# EAGLE design controlPanel (EAGLE 9.6.2)
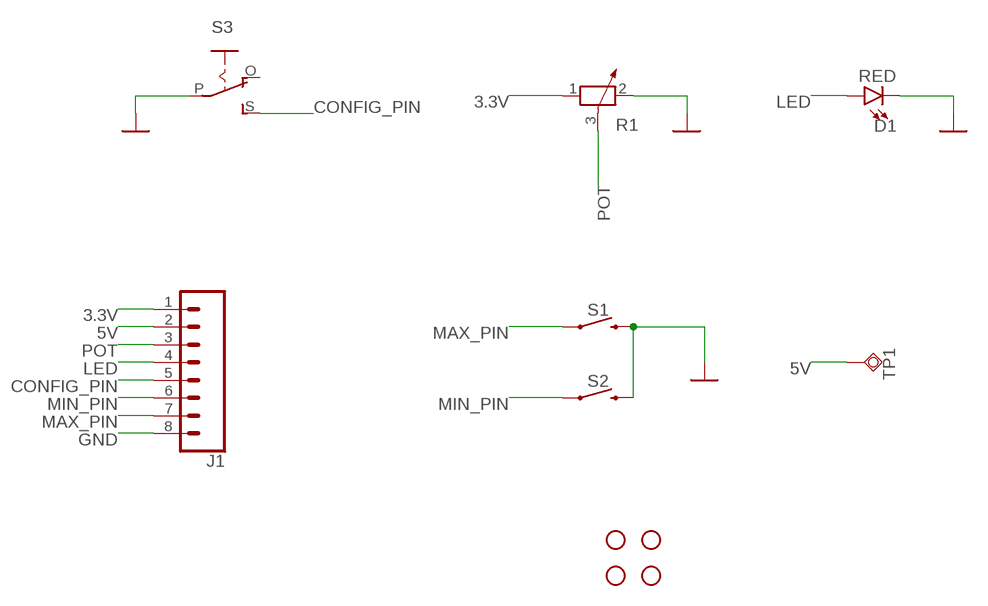
[diagram p0: schematic, sheet 1]

## Parts
D1  RED  SPARKFUN-LED_LED-RED0603  [SPARKFUN-LED_LED-0603]
H1  STAND-OFFTIGHT  [STAND-OFF-TIGHT]
H2  STAND-OFFTIGHT  [STAND-OFF-TIGHT]
H3  STAND-OFFTIGHT  [STAND-OFF-TIGHT]
H4  STAND-OFFTIGHT  [STAND-OFF-TIGHT]
J1  CONN_08SMD-COMBO-FEMALE  [1X08_SMD_COMBINED]
R1  RCL_POTENTIOMETER_PT-10  [RCL_PT-10]
S1  SPARKFUN-SWITCHES_MOMENTARY-SWITCH-SPST-PTH-12MM  [SPARKFUN-SWITCHES_TACTILE_SWITCH_PTH_12MM]
S2  SPARKFUN-SWITCHES_MOMENTARY-SWITCH-SPST-PTH-12MM  [SPARKFUN-SWITCHES_TACTILE_SWITCH_PTH_12MM]
S3  ADAFRUIT_EG1218S  [ADAFRUIT_EG1218]
TP1  TESTPAD_TPSQTP20R  [TESTPAD_TP20R]

## Nets
3.3V: J1.1 R1.1
5V: J1.2 TP1.TP
CONFIG_PIN: J1.5 S3.S
GND: D1.C J1.8 R1.2 S1.3 S2.3 S3.P ; supply symbol labelled 3-5-PIN-SMD_GND
LED: D1.A J1.4
MAX_PIN: J1.7 S1.1
MIN_PIN: J1.6 S2.1
POT: J1.3 R1.3
Unconnected: S3.O

## Library data of the parts
D1 = controlPanel:SPARKFUN-LED_LED-RED: Red SMD LED Used in manufacturing of most products at SparkFun Packages: 0603 - SMD 0603 package [Product Link] <http://docs.avagotech.com/docs/AV02-0551EN> 0603 SMART - SMD 0603 SMART package ( more efficient and expensive)[Product Link] <http://www.osram-os.com/Graphics/XPic2/00077099_0.pdf> 1206 - SMD1206 package [Product Link] <https://www.sparkfun.com/datasheets/DevTools/LilyPad/Q150OVS4.pdff> SparkFun Products: Pro Mini 328 -5V <https://www.sparkfun.com/products/821> RedBoard <https://www.sparkfun.com/products/12757> IOIO-OTG <https://www.sparkfun.com/products/13613>; PROD_ID: DIO-00819
H1-H4 = SparkFun-Hardware:STAND-OFF: Stand Off Drill holes for mechanically mounting via screws, standoffs, etc. Note: Use the keepout ring to avoid running the screw head into surrounding components. Variant Overviews STAND-OFF - Mechanical footprint for a #4 phillips button head screw. STAND-OFF-TIGHT - Mechanical footprint for a #4 phillips button head screw, Example SparkFun Products Screw - Phillips Head (1/4", 4-40, 10 pack) <https://www.sparkfun.com/products/10453> (PRT-10453) Screw - Phillips Head (1/2", 4-40, 10 pack) <https://www.sparkfun.com/products/10452> (PRT-10452) Screw - Phillips Head (3/4", 4-40, 10 pack) <https://www.sparkfun.com/products/10451> (PRT-10451) Screw - Phillips Head (1", 4-40, 10 pack) <https://www.sparkfun.com/products/10450> (PRT-10450)
J1 = SparkFun-Connectors:CONN_08: Multi connection point. Often used as Generic Header-pin footprint for 0.1 inch spaced/style header connections On any of the 0.1 inch spaced packages, you can populate with these: Break Away Headers - Straight <https://www.sparkfun.com/products/116> (PRT-00116) Break Away Male Headers - Right Angle <https://www.sparkfun.com/products/553> (PRT-00553) Female Headers <https://www.sparkfun.com/products/115> (PRT-00115) Break Away Headers - Machine Pin <https://www.sparkfun.com/products/117> (PRT-00117) Break Away Female Headers - Swiss Machine Pin <https://www.sparkfun.com/products/743> (PRT-00743) Arduino Stackable Header - 8 Pin <https://www.sparkfun.com/products/9279> (PRT-09279) For SCREWTERMINALS and SPRING TERMINALS visit here: Screw Terimnals on SparkFun.com <https://www.sparkfun.com/search/results?term=Screw+Terminals> (5mm/3.5mm/2.54mm spacing) This device is also useful as a general connection point to wire up your design to another part of your project. Our various solder wires solder well into these plated through hole pads. Hook-Up Wire - Assortment (Stranded, 22 AWG) <https://www.sparkfun.com/products/11375> (PRT-11375) Hook-Up Wire - Assortment (Solid Core, 22 AWG) <https://www.sparkfun.com/products/11367> (PRT-11367) View the entire wire category on our website here <https://www.sparkfun.com/categories/141> Special notes: Molex polarized connector foot print use with SKU : PRT-08231 with associated crimp pins and housings. 1MM SMD Version SKU: PRT-10208 NOTES ON THE VARIANTS LOCK and LOCK_LONGPADS... This footprint was designed to help hold the alignment of a through-hole component (i.e. 6-pin header) while soldering it into place. You may notice that each hole has been shifted either up or down by 0.005 of an inch from it's more standard position (which is a perfectly straight line). This slight alteration caused the pins (the squares in the middle) to touch the edges of the holes. Because they are alternating, it causes a "brace" to hold the component in place. 0.005 has proven to be the perfect amount of "off-center" position when using our standard breakaway headers. Although looks a little odd when you look at the bare footprint, once you have a header in there, the alteration is very hard to notice. Also,if you push a header all the way into place, it is covered up entirely on the bottom side.; PROD_ID: CONN-10204; SF_ID: PRT-11543
R1 = controlPanel:RCL_POTENTIOMETER_: Potentiometer
S1 S2 = controlPanel:SPARKFUN-SWITCHES_MOMENTARY-SWITCH-SPST: Momentary Switch (Pushbutton) - SPST Normally-open (NO) SPST momentary switches (buttons, pushbuttons). Variants PTH-12MM - 12mm square, through-hole Momentary Pushbutton Switch - 12mm Square <https://www.sparkfun.com/products/9190> (COM-09190) PTH-6.0MM, PTH-6.0MM-KIT - 6.0mm square, through-hole Mini Pushbutton Switch <https://www.sparkfun.com/products/97> (COM-00097) KIT package intended for soldering kit's - only one side of pads' copper is exposed. PTH-RIGHT-ANGLE-KIT - Right-angle, through-hole Right Angle Tactile Button <https://www.sparkfun.com/products/10791> - Used on SparkFun BigTime Watch Kit <https://www.sparkfun.com/products/11734> SMD-12MM - 12mm square, surface-mount Tactile Button - SMD (12mm) <https://www.sparkfun.com/products/12993> (COM-12993) Used on SparkFun PicoBoard <https://www.sparkfun.com/products/11888> SMD-4.5MM - 4.5mm Square Trackball Switch Used on SparkFun Blackberry Trackballer Breakout <https://www.sparkfun.com/products/13169> SMD-4.6MMX2.8MM - 4.60mm x 2.80mm, surface mount Used on SparkFun SAMD21 Mini Breakout <https://www.sparkfun.com/products/13664> SMD-5.2MM, SMD-5.2-REDUNDANT - 5.2mm square, surface-mount Mini Pushbutton Switch - SMD <https://www.sparkfun.com/products/8720> (COM-08720) Used on Arduino Pro Mini <https://www.sparkfun.com/products/11114> REDUNDANT package connects both switch circuits together SMD-6.0X3.5MM - 6.0 x 3.5mm, surface mount Momentary Reset Switch SMD <https://www.sparkfun.com/products/8229> (COM-08229) SMD-6.2MM-TALL - 6.2mm square, surface mount Tactile Button - SMD (6mm) <https://www.sparkfun.com/products/12992> Used on SparkFun Digital Sandbox <https://www.sparkfun.com/products/12651> SMD-RIGHT-ANGLE - Right-angle, surface mount Used on SparkFun Block for Intel® Edison - Arduino <https://www.sparkfun.com/products/13036>; PROD_ID: SWCH-09185; SF_SKU: COM-09190
S3 = controlPanel:ADAFRUIT_EG1218: SLIDING SWITCH 0.1" spacing through hole, vertical SPDT slide switch http://www.ladyada.net/library/pcb/eaglelibrary.html
TP1 = ARDUINO_3V_TTL_INTERFACE_2_PI:TESTPAD_TPSQ: Test pad

## Board
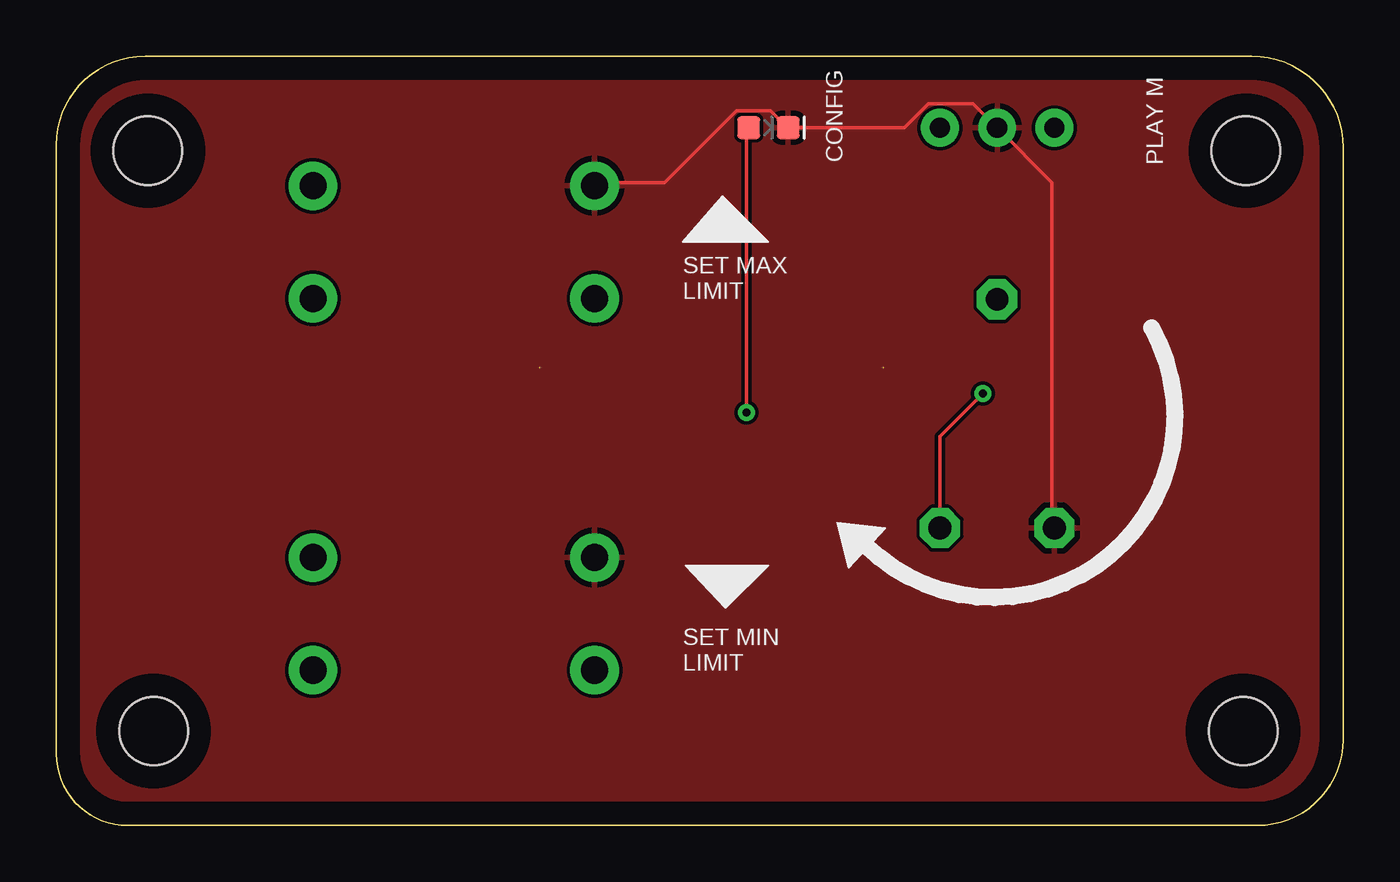
[diagram p1: board, top side]
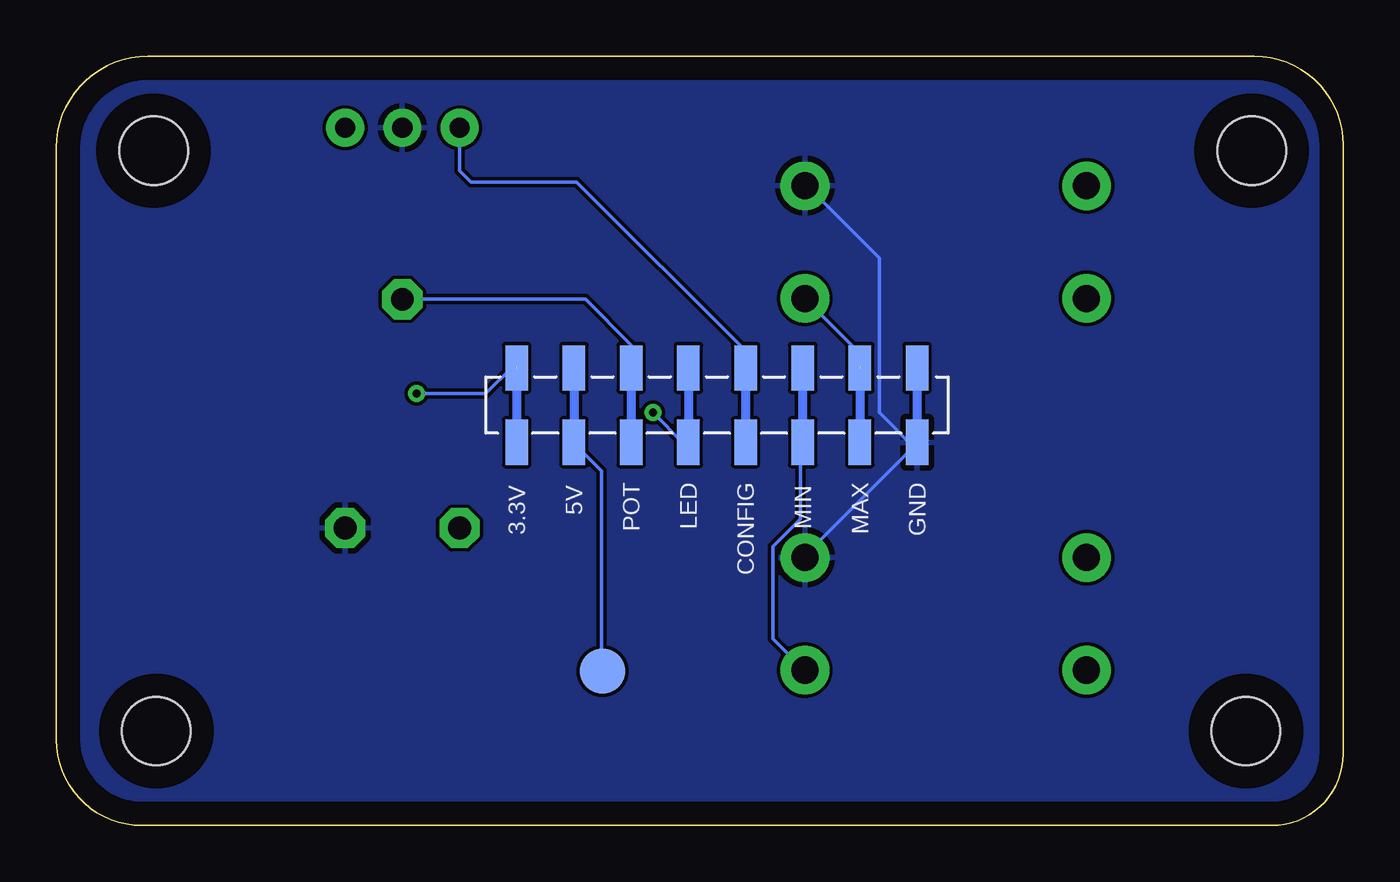
[diagram p2: board, bottom side, seen from below]

Size 57.15 x 34.16 mm. Coordinates in mm from the lower left corner, seen from the top.
Outline: 0,29.08 0,28.96 0,3.18 arc90 3.17,0 53.34,0 arc90 57.15,3.81 57.15,30.1 arc90 53.09,34.16 3.94,34.16 arc90 0,30.23 0,29.08
Copper layers (1*16): Top 0.035mm / dielectric 1.5mm / Bottom 0.035mm
Design rules "default": minimum track width 6mil, minimum drill 0.35mm, track to track 6mil, track to pad 6mil, pad to pad 6mil, via to via 6mil, smd to smd 6mil, copper to edge 40mil, drill to drill 6mil, minimum pad ring 10mil, minimum via ring 8mil, stop-mask expansion 4mil, vias tented up to drill 0mil, thermal gap 10mil

### Footprints (pad centres in the part's own frame; a part is rotated, then mirrored left to right if it is on the bottom)
SPARKFUN-LED_LED-0603 = smd 1 x 1: A -0.877,0; C 0.877,0
STAND-OFF-TIGHT = hole 3.048: 0,0
1X08_SMD_COMBINED = smd 1 x 2: 1 0,1.65; 1@2 0,-1.65; 2 2.54,-1.65; 2@2 2.54,1.65; 3 5.08,1.65; 3@2 5.08,-1.65; 4 7.62,-1.65; 4@2 7.62,1.65; 5 10.16,1.65; 5@2 10.16,-1.65; 6 12.7,-1.65; 6@2 12.7,1.65; 7 15.24,1.65; 7@2 15.24,-1.65; 8 17.78,-1.65; 8@2 17.78,1.65
RCL_PT-10 = drill 1.016 pad 1.778 octagon: 1 -2.54,-5.08; 2 2.54,-5.08; 3 0,5.08
SPARKFUN-SWITCHES_TACTILE_SWITCH_PTH_12MM = drill 1.2 pad 2.159: 1 6.25,-2.5; 2 -6.25,-2.5; 3 6.25,2.5; 4 -6.25,2.5
ADAFRUIT_EG1218 = drill 0.9 pad 1.676: O -2.54,0; P 0,0; S 2.54,0
TESTPAD_TP20R = smd 2 x 2: TP 0,0

### Placement (x,y rotation side)
D1  31.62,30.99 0 top
H1  4.32,4.19 0 top
H2  4.06,29.97 0 top
H3  52.83,29.97 0 top
H4  52.7,4.19 0 top
J1  36.7,18.67 0 bottom
R1  41.78,18.29 0 top
S1  17.65,25.91 0 top
S2  17.65,9.4 0 top
S3  41.78,30.99 180 top
TP1  32.89,6.86 0 bottom

### Tracks (layer width: path | path; a pad name or v marks a point on that pad's centre or on a via)
3.3V  (via drill 0.35)  (1 unrouted)
  Top 0.152: R1.1 39.24,17.27 v41.15,19.18
  Bottom 0.152: 36.7,20.37 36.88,20.37 38.08,19.18 v41.15,19.18
5V
  Bottom 0.152: TP1.TP 32.94,6.91 32.94,15.75 34.16,16.97 J1.2
CONFIG_PIN
  Bottom 0.152: J1.5 26.54,21.08 34.04,28.57 38.73,28.57 39.24,29.08 S3.S
GND
  Top 0.152: R1.2 44.22,13.31 44.22,28.55 S3.P 40.72,32.05 38.73,32.05 37.67,30.99 D1.C 32.49,30.99 31.73,31.75 30.2,31.75 27,28.55 23.95,28.55 S1.3
  Bottom 0.152: 19.08,16.82 23.95,11.94 S2.3 | 19.08,16.82 18.92,16.97 J1.8 19.08,16.82 | 19.08,16.82 20.6,18.34 20.6,25.2 23.8,28.4 S1.3
  pour Top: -1.27,35.18 -1.27,-0.64 0.51,-2.41 56.01,-2.41 58.17,-0.25 58.17,33.27 57.4,34.04 54.86,36.58 0.76,36.58 0.13,36.58
  pour Bottom: -3.05,35.31 -3.05,-1.02 -1.27,-2.79 0.38,-4.45 63.5,-4.45 63.5,36.58 64.14,37.21 -1.27,37.21 -3.05,35.43
LED  (via drill 0.35)
  Top 0.152: v30.66,18.34 30.66,30.99 D1.A
  Bottom 0.152: v30.66,18.34 29.29,16.97 29.13,16.97 J1.4
MAX_PIN  (1 unrouted)
  Bottom 0.152: S1.1 21.46,20.97 21.46,20.37
MIN_PIN
  Bottom 0.152: J1.6 24.11,16.97 24.11,13.61 25.32,12.39 25.32,8.28 23.95,6.91 S2.1
POT
  Bottom 0.152: J1.3 31.62,21.34 33.65,23.37 R1.3

### Text on the board
tPlace: CONFIG | PLAY M | SET MAX / LIMIT | SET MIN / LIMIT
bPlace: GND | MAX | CONFIG | LED | POT | MIN | 5V | 3.3V